# EAGLE design 6_Button_Array (EAGLE 9.5.2)
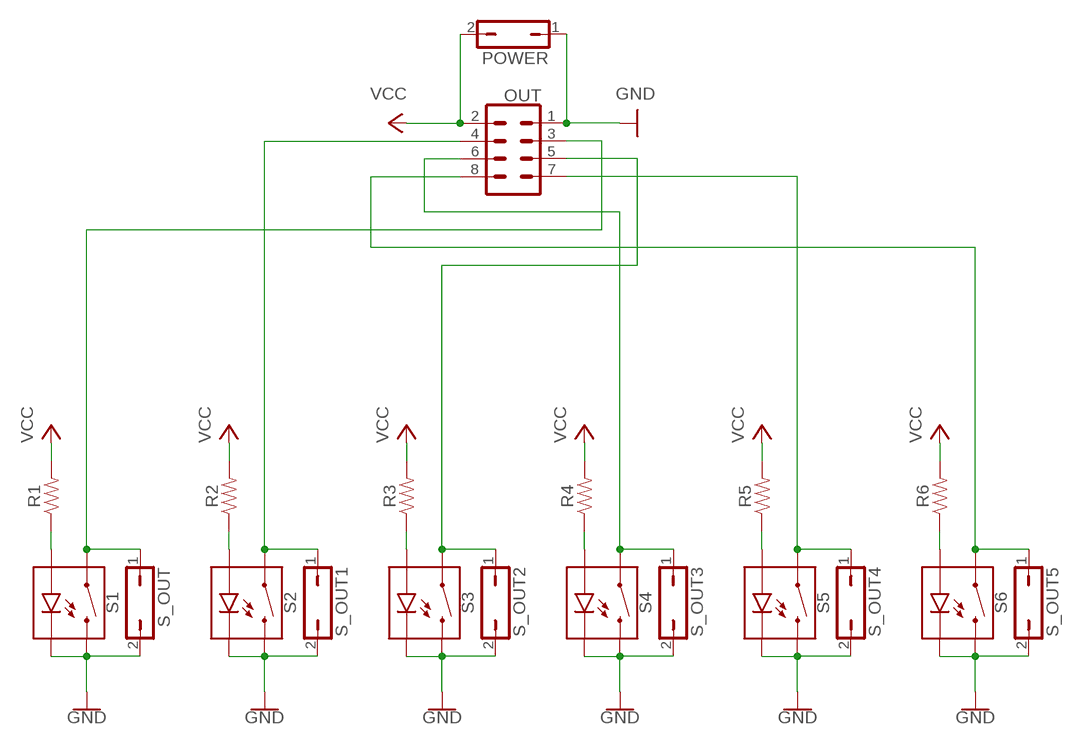
[diagram p0: schematic, sheet 1]

## Parts
OUT  CONN_04X2  [2X4]
POWER  JP1Q  [JP1]
R1  RESISTOR1206  [1206]
R2  RESISTOR1206  [1206]
R3  RESISTOR1206  [1206]
R4  RESISTOR1206  [1206]
R5  RESISTOR1206  [1206]
R6  RESISTOR1206  [1206]
S1  MOMENTARY-SWITCH-SPST-LED-PTH-12MM  [TACTILE_SWITCH_LED_PTH_12MM]
S2  MOMENTARY-SWITCH-SPST-LED-PTH-12MM  [TACTILE_SWITCH_LED_PTH_12MM]
S3  MOMENTARY-SWITCH-SPST-LED-PTH-12MM  [TACTILE_SWITCH_LED_PTH_12MM]
S4  MOMENTARY-SWITCH-SPST-LED-PTH-12MM  [TACTILE_SWITCH_LED_PTH_12MM]
S5  MOMENTARY-SWITCH-SPST-LED-PTH-12MM  [TACTILE_SWITCH_LED_PTH_12MM]
S6  MOMENTARY-SWITCH-SPST-LED-PTH-12MM  [TACTILE_SWITCH_LED_PTH_12MM]
S_OUT  JP1Q  [JP1]
S_OUT1  JP1Q  [JP1]
S_OUT2  JP1Q  [JP1]
S_OUT3  JP1Q  [JP1]
S_OUT4  JP1Q  [JP1]
S_OUT5  JP1Q  [JP1]

## Nets
GND: OUT.1 POWER.1 S1.2 S1.C S2.2 S2.C S3.2 S3.C S4.2 S4.C S5.2 S5.C S6.2 S6.C S_OUT1.2 S_OUT2.2 S_OUT3.2 S_OUT4.2 S_OUT5.2 S_OUT.2
N$2: R1.1 S1.A
N$3: R2.1 S2.A
N$5: R3.1 S3.A
N$6: OUT.5 S3.4 S_OUT2.1
N$7: R4.1 S4.A
N$8: OUT.6 S4.4 S_OUT3.1
N$9: R5.1 S5.A
N$10: OUT.7 S5.4 S_OUT4.1
N$11: R6.1 S6.A
N$12: OUT.3 S1.4 S_OUT.1
N$13: OUT.8 S6.4 S_OUT5.1
N$14: OUT.4 S2.4 S_OUT1.1
VCC: OUT.2 POWER.2 R1.2 R2.2 R3.2 R4.2 R5.2 R6.2

## Library data of the parts
OUT = SparkFun-Connectors:CONN_04X2: Multi connection point. Often used as Generic Header-pin footprint for 0.1 inch spaced/style header connections On any of the 0.1 inch spaced packages, you can populate with these: Break Away Headers - Straight <https://www.sparkfun.com/products/116> (PRT-00116) Break Away Male Headers - Right Angle <https://www.sparkfun.com/products/553> (PRT-00553) Female Headers <https://www.sparkfun.com/products/115> (PRT-00115) Break Away Headers - Machine Pin <https://www.sparkfun.com/products/117> (PRT-00117) Break Away Female Headers - Swiss Machine Pin <https://www.sparkfun.com/products/743> (PRT-00743)
POWER S_OUT S_OUT1-S_OUT5 = jumper:JP1Q: JUMPER
R1-R6 = SparkFun-Resistors:RESISTOR: Generic Resistor Package
S1-S6 = SparkFun-Switches:MOMENTARY-SWITCH-SPST-LED: Momentary Switch (Pushbutton) - SPST - w/ LED Normally-open (NO) SPST momentary switches (buttons, pushbuttons), with a built-in LED. Variants PTH-CHERRY - Cherry MX Switch Cherry MX Keyswitches are top-of-the-line mechanical keyboard switches. They’re satisfyingly “clicky”, reliable up to tens-of-millions of key presses, and a standard in gaming and programming keyboards across the globe. This ‘blue’ version Cherry MX Switch is favored by most due to its secondary internal actuator making it less likely to “double-tap.” If you are looking for a noticeably audible and high-quality key switch, this is the perfect option for you! Cherry MX Switch <https://www.sparkfun.com/products/13834> (COM-13834) Cherry MX Switch Breakout <https://www.sparkfun.com/products/13773> (BOB-13773) PTH-12MM and PTH-12MM-KIT - 12mm Illuminated LED KIT variant is for soldering kits. There is no tStop (covering up the top side of the pads with mask). This helps the beginner see which side they should be soldering too. LED Tactile Button Breakout <https://www.sparkfun.com/products/10467> (BOB-10467) LED Tactile Button - Red <https://www.sparkfun.com/products/10442> (COM-10442) LED Tactile Button - Blue <https://www.sparkfun.com/products/10443> (COM-10443) LED Tactile Button - Green <https://www.sparkfun.com/products/10440> (COM-10440) LED Tactile Button - Orange <https://www.sparkfun.com/products/10441> (COM-10441) LED Tactile Button - White <https://www.sparkfun.com/products/10439> (COM-10439); PROD_ID: SWCH-11758; SF_SKU: COM-10442

## Board
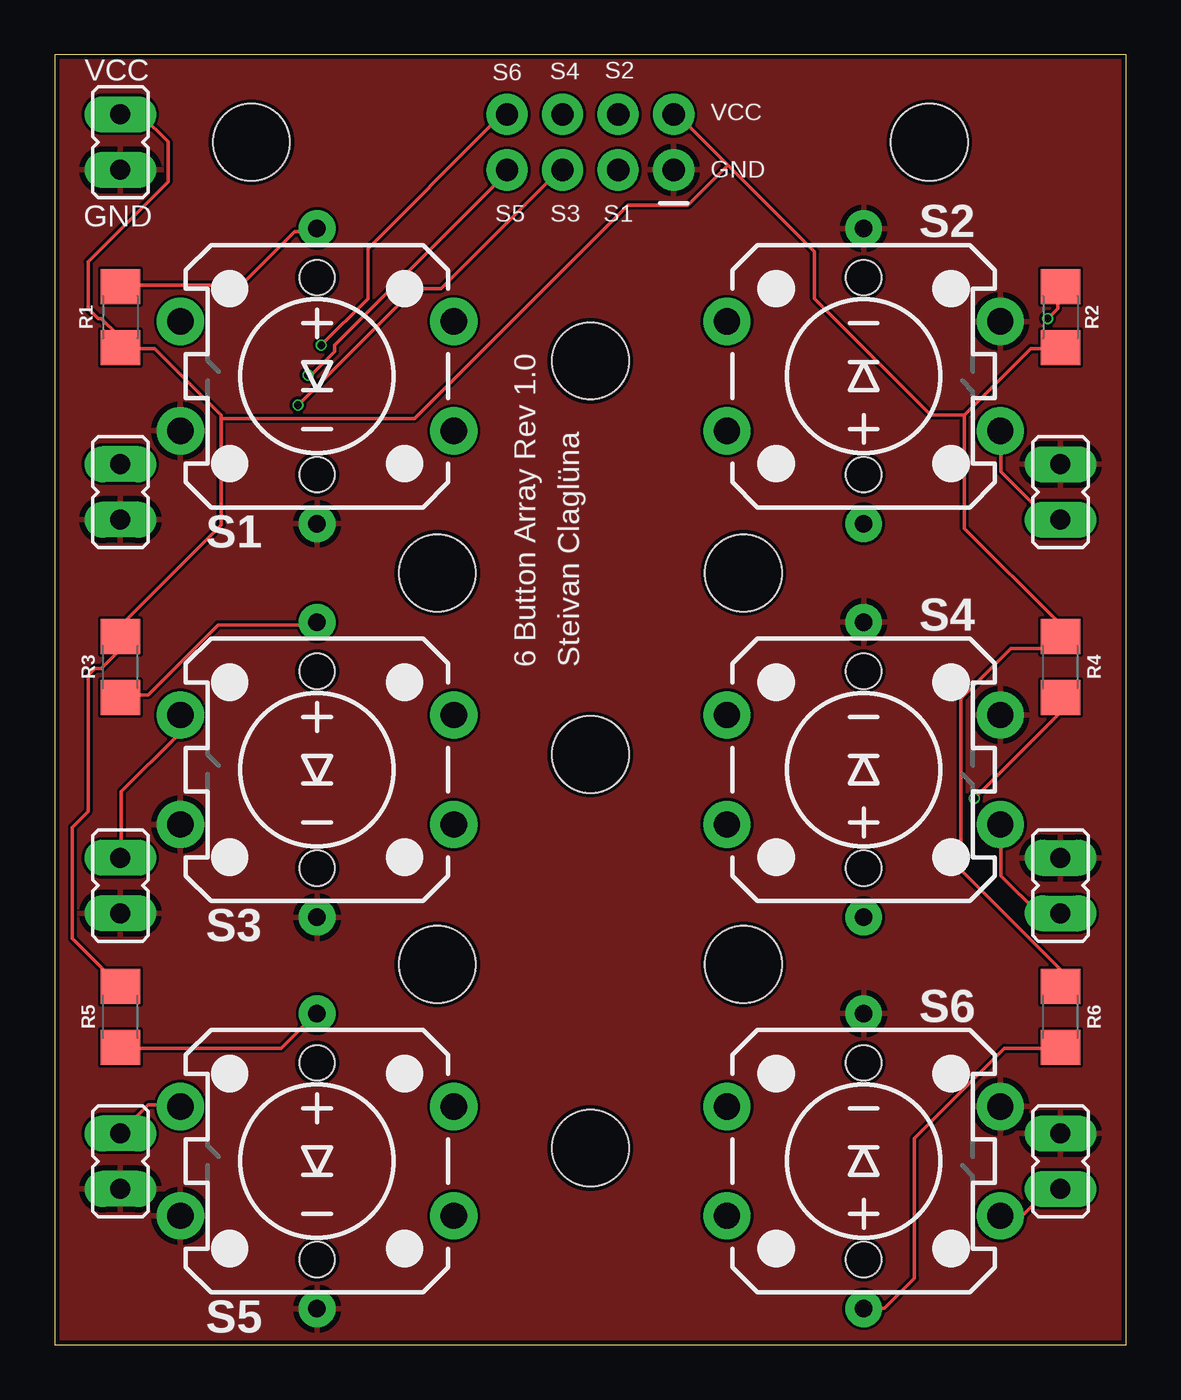
[diagram p1: board, top side]
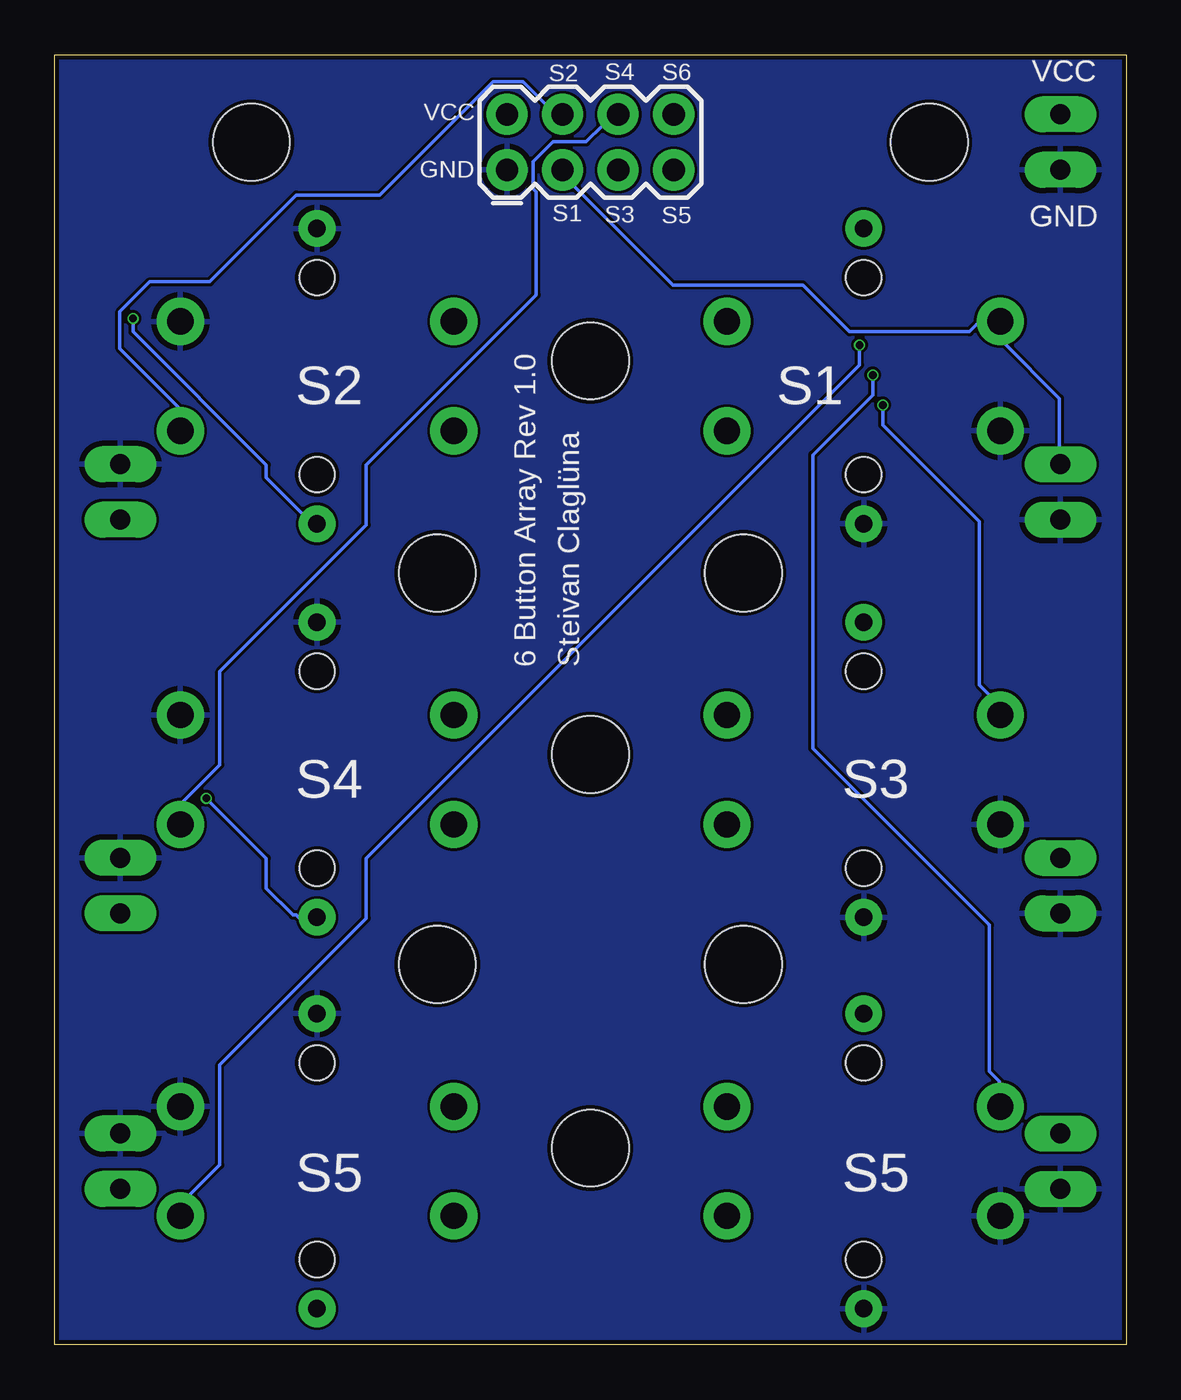
[diagram p2: board, bottom side, seen from below]

Size 49 x 59 mm. Coordinates in mm from the lower left corner, seen from the top.
Outline: 0,0 49,0 49,59 0,59 0,0
Copper layers (1*16): Top 0.035mm / dielectric 1.6mm / Bottom 0.035mm
Design rules "jlcpcb-2layers": minimum track width 5mil, minimum drill 0.3mm, track to track 5mil, track to pad 5mil, pad to pad 5mil, via to via 5mil, smd to smd 5mil, copper to edge 0.2mm, drill to drill 6mil, minimum pad ring 10mil, minimum via ring 3mil, stop-mask expansion 4mil, vias tented up to drill 0mil, thermal gap 10mil
Holes 3.5 mm at 24.5,9 24.5,27 9,55 40,55 24.5,45 17.5,17.4 31.5,17.4 17.5,35.3 31.5,35.3

### Footprints (pad centres in the part's own frame; a part is rotated, then mirrored left to right if it is on the bottom)
2X4 = drill 1.016 pad 1.88: 1 -3.81,-1.27; 2 -3.81,1.27; 3 -1.27,-1.27; 4 -1.27,1.27; 5 1.27,-1.27; 6 1.27,1.27; 7 3.81,-1.27; 8 3.81,1.27
JP1 = drill 0.914 long: 1 0,-1.27; 2 0,1.27
1206 = smd 1.6 x 1.8: 1 -1.4,0; 2 1.4,0
TACTILE_SWITCH_LED_PTH_12MM = drill 1.2 pad 2.159: 1 -6.25,2.5; 2 6.25,2.5; 3 -6.25,-2.5; 4 6.25,-2.5 | drill 0.8 pad 1.676: A 0,-6.75; C 0,6.75 | hole 1.6: 0,4.5; 0,-4.5

### Placement (x,y rotation side)
OUT  24.5,55 0 bottom
POWER  3,55 0 top
R1  3,47 270 top
R2  46,47 270 top
R3  3,31 90 top
R4  46,31 90 top
R5  3,15 90 top
R6  46,15 90 top
S1  12,44.3 180 top
S2  37,44.3 0 top
S3  12,26.3 180 top
S4  37,26.3 0 top
S5  12,8.4 180 top
S6  37,8.4 0 top
S_OUT  3,39 180 top
S_OUT1  46,39 0 top
S_OUT2  3,21 180 top
S_OUT3  46,21 0 top
S_OUT4  3,8.4 180 top
S_OUT5  46,8.4 0 top

### Tracks (layer width: path | path; a pad name or v marks a point on that pad's centre or on a via)
GND
  pour Bottom: 0,59 49,59 49,0 0,0
  pour Top: 0,59 49,59 49,0 0,0
N$2
  Top 0.152: R1.1 3.05,48.46 8.53,48.46 10.97,50.9 11.89,50.9 S1.A
N$3  (via drill 0.35)
  Top 0.152: v45.41,46.94 45.87,47.4 45.87,48.31 R2.1
  Bottom 0.152: v45.41,46.94 45.41,46.33 39.32,40.23 39.32,39.65 37.16,37.49 37.03,37.49 S2.A
N$5
  Top 0.152: R3.1 3.05,29.72 4.27,29.72 7.47,32.92 11.89,32.92 S3.A
N$6  (via drill 0.35)
  Top 0.152: S_OUT2.1 3.05,22.32 3.05,25.3 5.64,27.89 5.64,28.65 S3.4 | v11.12,42.98 16.46,48.31 17.68,48.31 22.55,53.19 22.71,53.19 23.16,53.65 OUT.5
  Bottom 0.152: v11.12,42.98 11.12,42.06 6.71,37.64 6.71,30.18 5.79,29.26 5.79,28.8 S3.4
N$7  (via drill 0.35)
  Top 0.152: v42.06,24.99 45.87,28.8 45.87,29.57 R4.1
  Bottom 0.152: v42.06,24.99 39.32,22.25 39.32,20.88 38.1,19.66 37.95,19.66 37.8,19.51 37.03,19.51 S4.A
N$8
  Top 0.152: S_OUT3.1 45,19.73 43.28,21.45 43.28,23.77 S4.4
  Bottom 0.152: OUT.6 23.32,56.24 23.77,55.78 23.93,55.78 24.69,55.02 26.21,55.02 27.13,54.1 27.13,52.88 26.98,52.73 26.98,48.01 34.75,40.23 34.75,37.49 41.45,30.79 41.45,26.52 43.23,24.74 43.23,23.82 S4.4
N$9
  Top 0.152: R5.1 3.05,13.56 10.36,13.56 11.89,15.09 S5.A
N$10  (via drill 0.35)
  Top 0.152: S_OUT4.1 3.05,9.75 4.27,10.97 5.64,10.97 S5.4 | v11.58,44.35 11.73,44.35 12.8,45.41 12.8,45.72 20.12,53.03 20.12,53.19 20.57,53.65 OUT.7
  Bottom 0.152: v11.58,44.35 11.58,43.43 14.33,40.69 14.33,27.28 6.25,19.2 6.25,12.5 5.79,12.04 5.79,10.97 S5.4
N$11
  Top 0.152: R6.1 45.87,13.56 43.43,13.56 39.32,9.45 39.32,3.05 37.95,1.68 37.03,1.68 S6.A
N$12
  Bottom 0.152: S_OUT.1 3.05,40.39 3.05,43.28 5.64,45.87 5.64,46.79 S1.4 5.79,46.79 6.71,46.79 7.16,46.33 12.65,46.33 14.78,48.46 20.73,48.46 25.73,53.46 OUT.3
N$13  (via drill 0.35)
  Top 0.152: S_OUT5.1 45.48,7.13 44.25,5.9 S6.4 | v12.19,45.72 14.33,47.85 14.33,50.14 19.96,55.78 20.12,55.78 20.57,56.24 OUT.8
  Bottom 0.152: v12.19,45.72 12.19,44.81 34.75,22.25 34.75,19.51 41.45,12.8 41.45,8.23 43.13,6.55 43.13,5.94 S6.4
N$14
  Top 0.152: S_OUT1.1 45.87,37.8 45.41,37.8 43.28,39.93 43.28,41.76 S2.4
  Bottom 0.152: OUT.4 25.91,56.39 26.21,56.39 27.58,57.76 28.96,57.76 34.14,52.58 37.95,52.58 41.91,48.62 44.65,48.62 46.02,47.24 46.02,45.57 43.28,42.82 43.28,41.91 S2.4
VCC
  Top 0.152: POWER.2 3.05,56.24 3.96,56.24 5.18,55.02 5.18,53.19 1.52,49.53 1.52,47.4 1.98,46.94 2.13,46.94 2.9,46.18 2.9,45.72 R1.2 3.05,45.57 4.57,45.57 7.62,42.52 7.62,42.37 | R5.2 0.81,18.59 0.81,23.67 1.52,24.38 1.52,30.63 1.83,30.94 2.13,30.94 2.9,31.7 2.9,32.31 R3.2 3.05,32.46 3.05,32.92 7.62,37.49 7.62,42.37 | R6.2 46.02,16.46 46.02,17.14 41.45,21.71 41.45,29.57 43.74,31.85 45.41,31.85 45.87,32.31 R4.2 45.87,32.46 45.87,33.07 41.6,37.34 41.6,42.52 | 41.6,42.52 44.65,45.57 45.87,45.57 R2.2 | 30.79,53.95 34.75,49.99 34.75,47.85 40.08,42.52 41.6,42.52 | 30.79,53.95 28.96,55.78 28.8,55.78 28.35,56.24 OUT.2 | 7.62,42.37 16.46,42.37 26.21,52.12 28.96,52.12 30.79,53.95

### Text on the board
tNames: VCC | S6 | S4 | S2 | VCC | GND | GND | S5 | S3 | S1 | 6 Button Array Rev 1.0 | Steivan Claglüna
bNames: VCC | S6 | S4 | S2 | VCC | GND | GND | S5 | S3 | S1 | S1 | S2 | Steivan Claglüna | 6 Button Array Rev 1.0 | S3 | S4 | S5 | S5